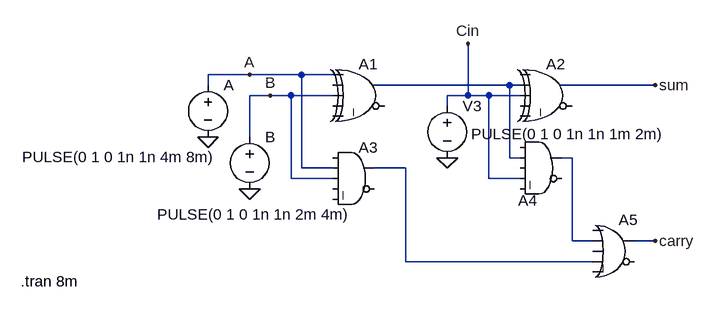
[diagram p0: schematic Full Adder.asc]
Full Adder.asc, the LTspice schematic file:
Version 4
SHEET 1 880 680
WIRE -128 96 -192 96
WIRE -48 96 -128 96
WIRE 0 96 -48 96
WIRE -192 112 -192 96
WIRE 272 112 64 112
WIRE 288 112 272 112
WIRE 496 112 352 112
WIRE -96 128 -128 128
WIRE -64 128 -96 128
WIRE 0 128 -64 128
WIRE 208 128 208 48
WIRE 208 128 176 128
WIRE 240 128 208 128
WIRE 288 128 240 128
WIRE 176 144 176 128
WIRE -128 192 -128 128
WIRE 272 224 272 112
WIRE 288 224 272 224
WIRE 368 224 352 224
WIRE -48 240 -48 96
WIRE 0 240 -48 240
WIRE 112 240 64 240
WIRE -64 256 -64 128
WIRE 0 256 -64 256
WIRE 240 256 240 128
WIRE 288 256 240 256
WIRE 368 352 368 224
WIRE 400 352 368 352
WIRE 496 352 464 352
WIRE 112 384 112 240
WIRE 400 384 112 384
FLAG 176 224 0
FLAG -128 272 0
FLAG -192 192 0
FLAG 496 112 sum
FLAG 496 352 carry
FLAG -128 96 A
FLAG -96 128 B
FLAG 208 48 Cin
SYMBOL Digital\\xor 48 64 R0
SYMATTR InstName A1
SYMBOL Digital\\xor 336 64 R0
SYMATTR InstName A2
SYMBOL Digital\\and 32 192 R0
SYMATTR InstName A3
SYMBOL Digital\\and 320 176 R0
WINDOW 0 -35 114 Left 2
SYMATTR InstName A4
SYMBOL Digital\\or 432 304 R0
SYMATTR InstName A5
SYMBOL voltage -192 96 R0
WINDOW 3 -286 127 Left 2
WINDOW 123 0 0 Left 0
WINDOW 39 0 0 Left 0
SYMATTR InstName A
SYMATTR Value PULSE(0 1 0 1n 1n 4m 8m)
SYMBOL voltage -128 176 R0
WINDOW 3 -142 135 Left 2
WINDOW 123 0 0 Left 0
WINDOW 39 0 0 Left 0
SYMATTR InstName B
SYMATTR Value PULSE(0 1 0 1n 1n 2m 4m)
SYMBOL voltage 176 128 R0
WINDOW 3 37 59 Left 2
WINDOW 123 0 0 Left 0
WINDOW 39 0 0 Left 0
SYMATTR InstName V3
SYMATTR Value PULSE(0 1 0 1n 1n 1m 2m)
TEXT -480 414 Left 2 !.tran 8m

The netlist it stands for:
* Full Adder.asc
A1 A 0 B 0 0 0 N001 0 XOR
A2 0 N001 Cin 0 0 0 sum 0 XOR
A3 0 A B 0 0 0 N003 0 AND
A4 0 N001 0 Cin 0 0 N002 0 AND
A5 0 N002 0 N003 0 0 carry 0 OR
V§A A 0 PULSE(0 1 0 1n 1n 4m 8m)
V§B B 0 PULSE(0 1 0 1n 1n 2m 4m)
V3 Cin 0 PULSE(0 1 0 1n 1n 1m 2m)
.tran 8m
.backanno
.end